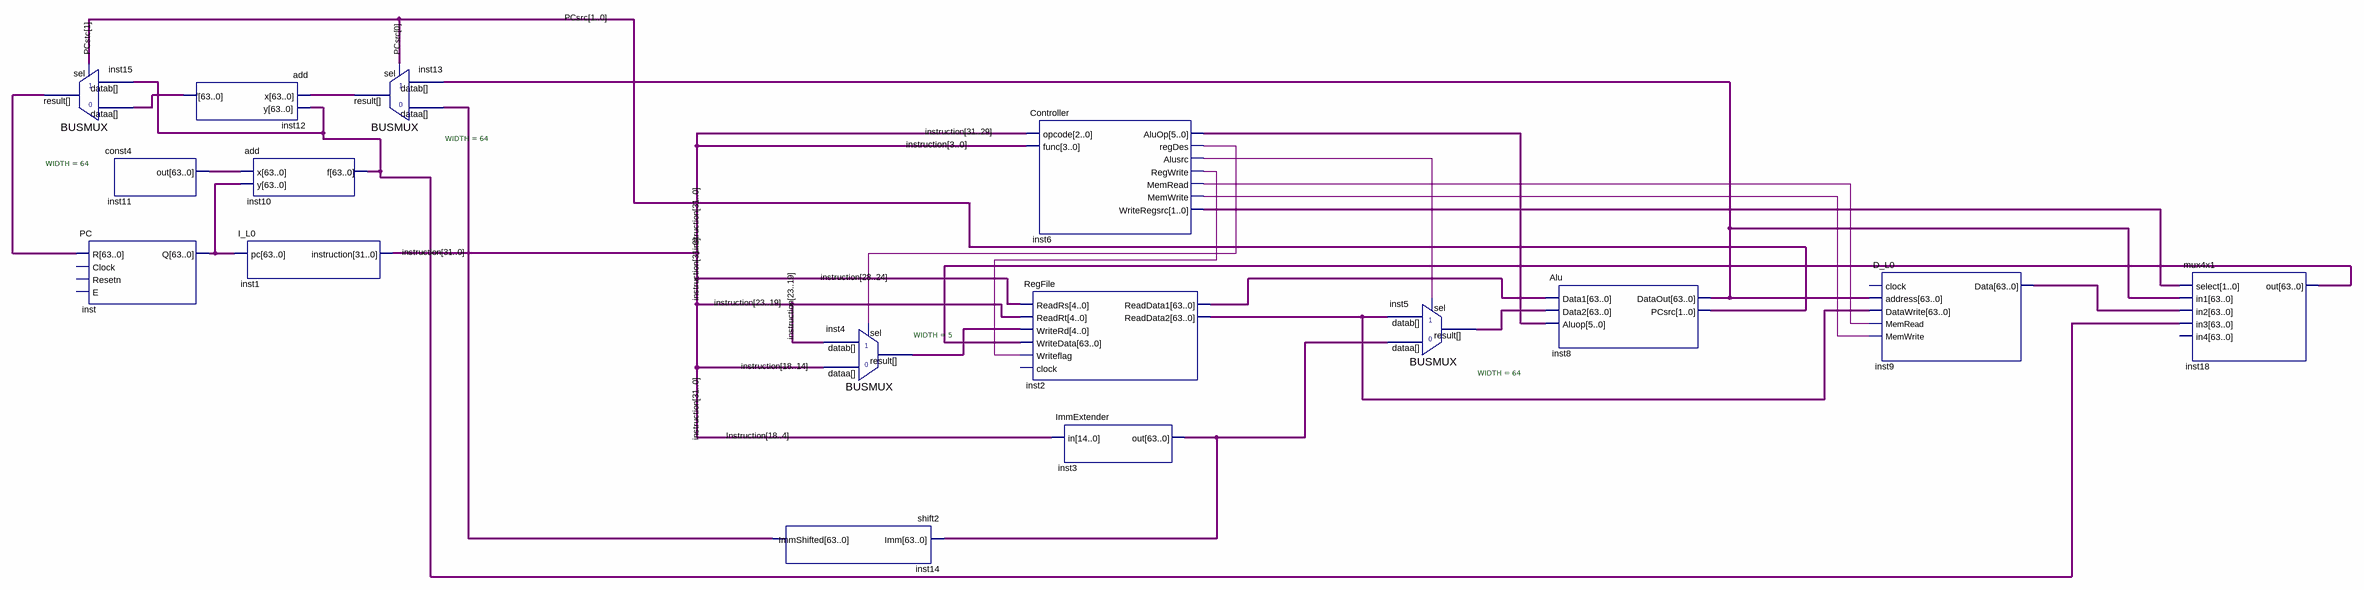
[diagram p0: schematic sheet]
// Quartus schematic core.bdf as structural Verilog: 16 symbols, 0 pins
module core (
);

  wire inst6_alusrc, inst6_memread, inst6_memwrite, inst6_regdes, inst6_regwrite;
  wire [1:0] inst6_writeregsrc, PCsrc;
  wire [1:1] PCstc;
  wire [4:0] inst4_result;
  wire [5:0] inst6_aluop;
  wire [31:0] instruction;
  wire [63:0] inst2_readdata1, inst2_readdata2, inst3_out, inst5_result, inst8_dataout, inst9_data, inst10_f,
       inst11_out, inst12_f, inst13_result, inst14_immshifted, inst15_result, inst18_out, inst_q;

  BUSMUX #(.WIDTH(64)) inst15 (.datab(inst10_f), .sel(PCstc[1]), .dataa(inst12_f), .result(inst15_result));
  PC inst (.R(inst15_result), .Q(inst_q));  // open: Clock, Resetn, E
  const4 inst11 (.out(inst11_out));
  add inst12 (.x(inst13_result), .y(inst10_f), .f(inst12_f));
  add inst10 (.x(inst11_out), .y(inst_q), .f(inst10_f));
  I_L0 inst1 (.pc(inst_q), .instruction(instruction));
  BUSMUX #(.WIDTH(64)) inst13 (
    .datab(inst8_dataout), .sel(PCsrc[0]), .dataa(inst14_immshifted), .result(inst13_result));
  shift2 inst14 (.Imm(inst3_out), .ImmShifted(inst14_immshifted));
  BUSMUX #(.WIDTH(5)) inst4 (
    .datab(instruction[23:19]), .sel(inst6_regdes), .dataa(instruction[18:14]), .result(inst4_result));
  Controller inst6 (
    .opcode(instruction[31:29]), .func(instruction[3:0]), .AluOp(inst6_aluop), .regDes(inst6_regdes),
    .Alusrc(inst6_alusrc), .RegWrite(inst6_regwrite), .MemRead(inst6_memread), .MemWrite(inst6_memwrite),
    .WriteRegsrc(inst6_writeregsrc));
  RegFile inst2 (
    .ReadRs(instruction[28:24]), .ReadRt(instruction[23:19]), .WriteRd(inst4_result), .WriteData(inst18_out),
    .Writeflag(inst6_regwrite), .ReadData1(inst2_readdata1), .ReadData2(inst2_readdata2));  // open: clock
  ImmExtender inst3 (.in(instruction[18:4]), .out(inst3_out));
  BUSMUX #(.WIDTH(64)) inst5 (.datab(inst2_readdata2), .sel(inst6_alusrc), .dataa(inst3_out), .result(inst5_result));
  Alu inst8 (
    .Data1(inst2_readdata1), .Data2(inst5_result), .Aluop(inst6_aluop), .DataOut(inst8_dataout), .PCsrc(PCsrc));
  D_L0 inst9 (
    .address(inst8_dataout), .DataWrite(inst2_readdata2), .MemRead(inst6_memread), .MemWrite(inst6_memwrite),
    .Data(inst9_data));  // open: clock
  mux4x1 inst18 (
    .select(inst6_writeregsrc), .in1(inst8_dataout), .in2(inst9_data), .in3(inst10_f), .out(inst18_out));  // open: in4
endmodule
